# Altium schematic sheet QCopterRC_LCD_Sch.SchDoc
size A4; DocumentNumber: 10; SheetNumber: 10; SheetTotal: 10
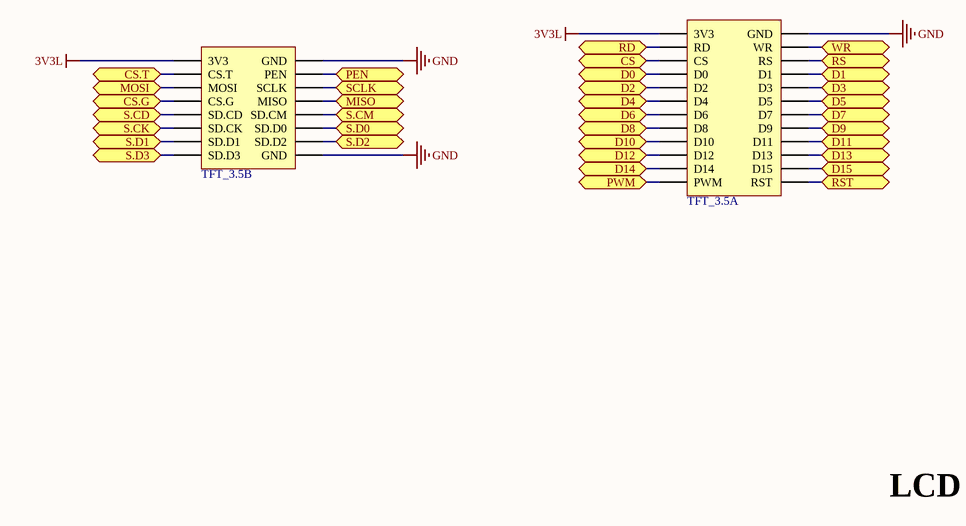
[diagram p0: QCopterRC_LCD_Sch.SchDoc]

## Parts
TFT_3.5  TFT_3.5_480*320  [TFT_3.5_480*320]  (value not drawn)  (parts A,B of 2)

## Ports
CS, CS.G, CS.T, D0, D1, D2, D3, D4, D5, D6, D7, D8, D9, D10, D11, D12, D13, D14, D15, MISO, MOSI, PEN, PWM, RD, RS, RST, S.CD, S.CK, S.CM, S.D0, S.D1, S.D2, S.D3, SCLK, WR

## Nets
3V3L: TFT_3.5.1(3V3) TFT_3.5.25(3V3)
GND: TFT_3.5.2(GND) TFT_3.5.26(GND) TFT_3.5.40(GND)
CS: TFT_3.5.5(CS) ; port CS
CS.G: TFT_3.5.31(CS.G) ; port CS.G
CS.T: TFT_3.5.27(CS.T) ; port CS.T
D0: TFT_3.5.7(D0) ; port D0
D1: TFT_3.5.8(D1) ; port D1
D2: TFT_3.5.9(D2) ; port D2
D3: TFT_3.5.10(D3) ; port D3
D4: TFT_3.5.11(D4) ; port D4
D5: TFT_3.5.12(D5) ; port D5
D6: TFT_3.5.13(D6) ; port D6
D7: TFT_3.5.14(D7) ; port D7
D8: TFT_3.5.15(D8) ; port D8
D9: TFT_3.5.16(D9) ; port D9
D10: TFT_3.5.17(D10) ; port D10
D11: TFT_3.5.18(D11) ; port D11
D12: TFT_3.5.19(D12) ; port D12
D13: TFT_3.5.20(D13) ; port D13
D14: TFT_3.5.21(D14) ; port D14
D15: TFT_3.5.22(D15) ; port D15
MISO: TFT_3.5.32(MISO) ; port MISO
MOSI: TFT_3.5.29(MOSI) ; port MOSI
PEN: TFT_3.5.28(PEN) ; port PEN
PWM: TFT_3.5.23(PWM) ; port PWM
RD: TFT_3.5.3(RD) ; port RD
RS: TFT_3.5.6(RS) ; port RS
RST: TFT_3.5.24(RST) ; port RST
S.CD: TFT_3.5.33(SD.CD) ; port S.CD
S.CK: TFT_3.5.35(SD.CK) ; port S.CK
S.CM: TFT_3.5.34(SD.CM) ; port S.CM
S.D0: TFT_3.5.36(SD.D0) ; port S.D0
S.D1: TFT_3.5.37(SD.D1) ; port S.D1
S.D2: TFT_3.5.38(SD.D2) ; port S.D2
S.D3: TFT_3.5.39(SD.D3) ; port S.D3
SCLK: TFT_3.5.30(SCLK) ; port SCLK
WR: TFT_3.5.4(WR) ; port WR

## Notes on the sheet
- LCD

## Library data of the parts
TFT_3.5 = TFT_3.5_480*320: Module